# EAGLE schematic untitled (EAGLE 6.0)
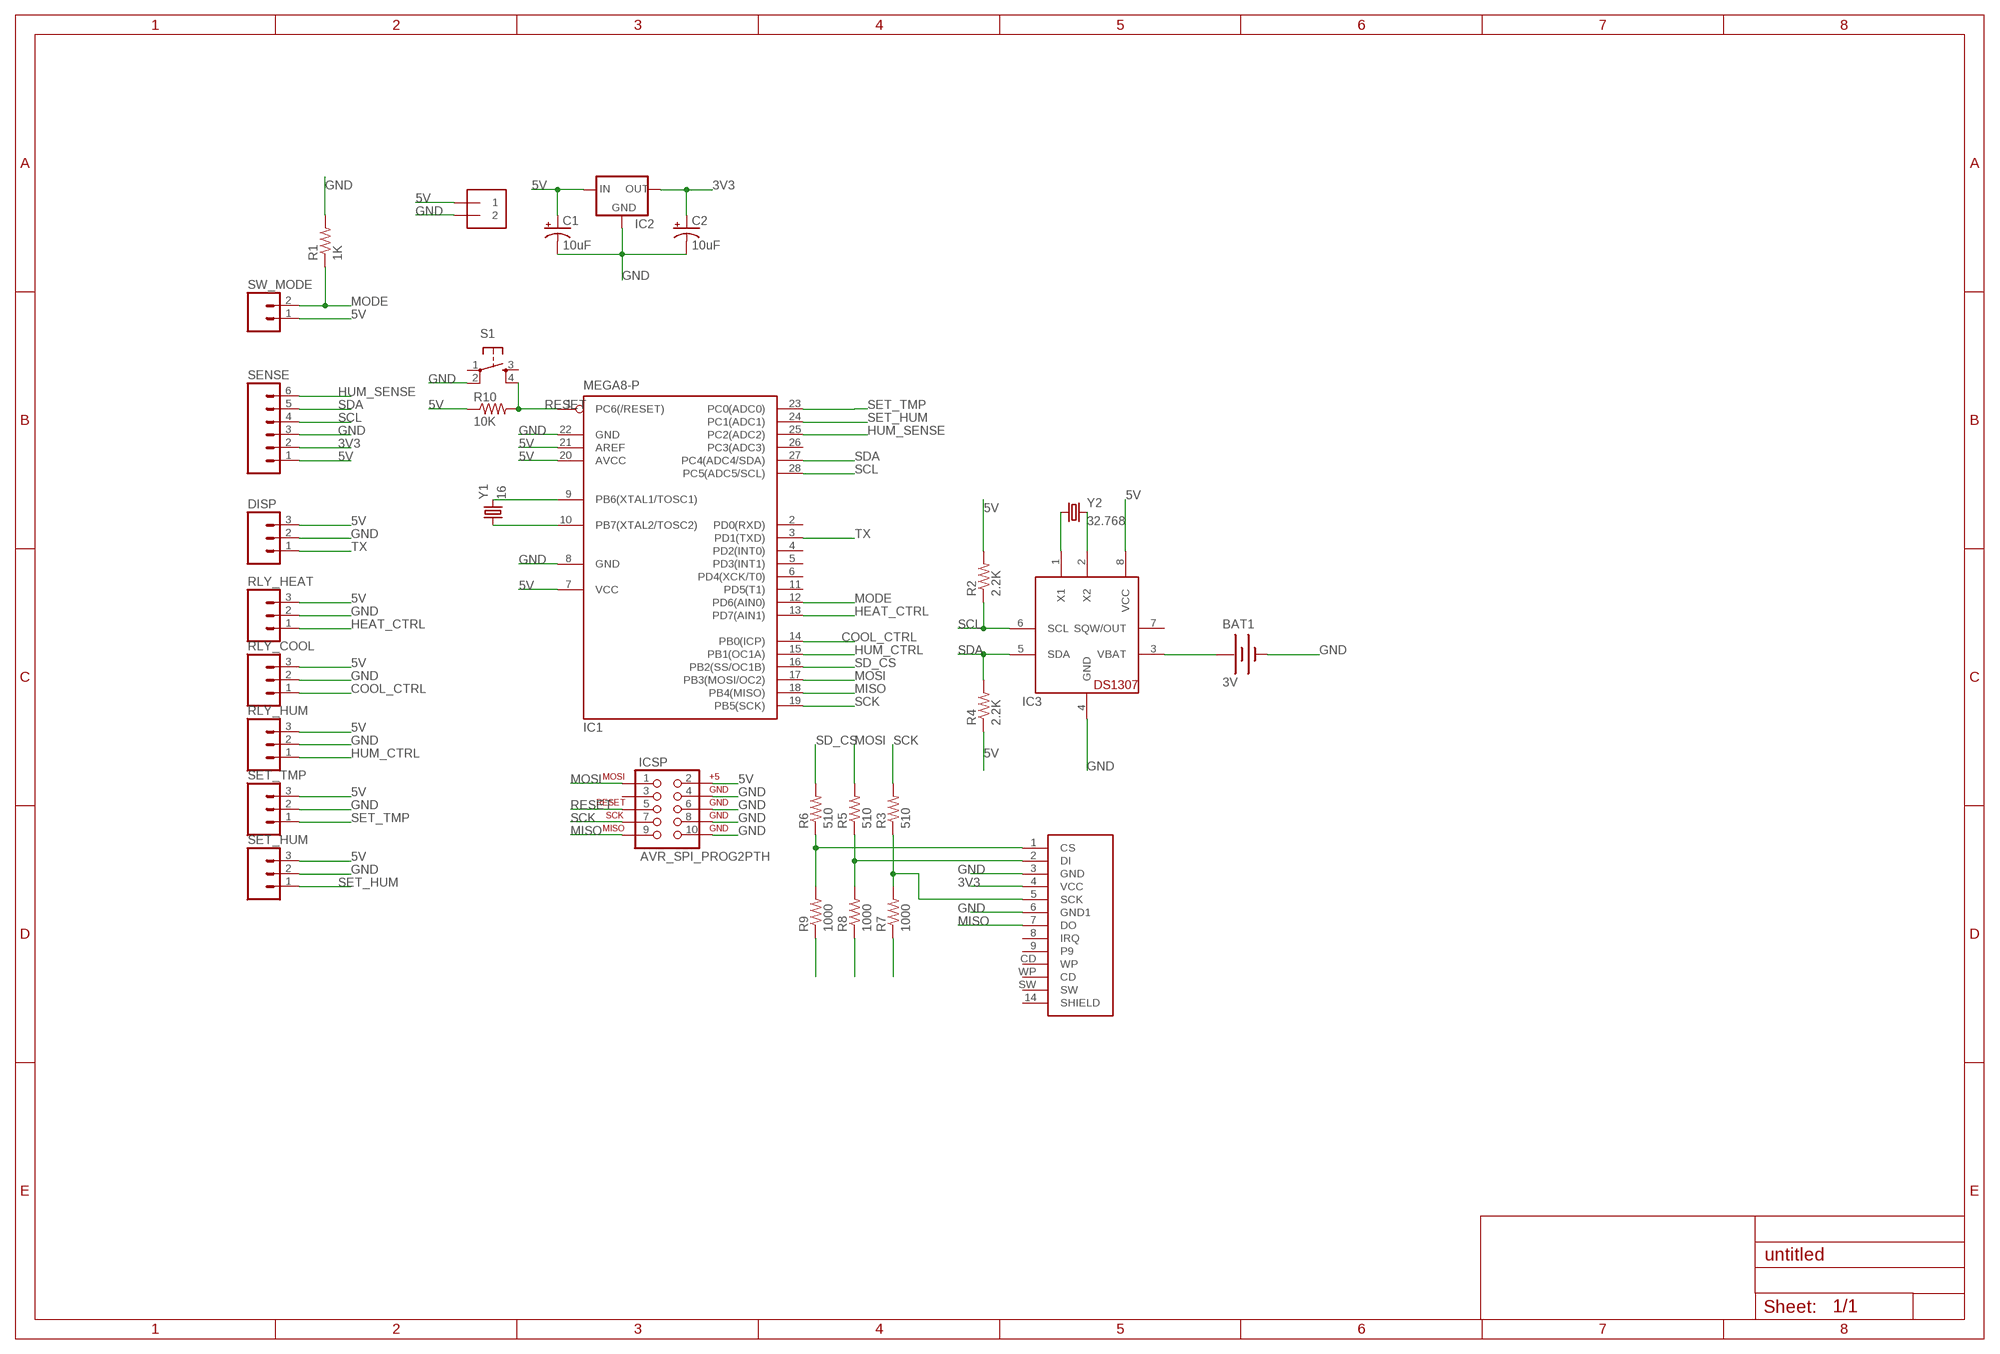
[diagram p0: schematic, sheet 1]

## Parts
BAT1  3V  BATTERY20PTH  [BATTCOM_20MM_PTH]
C1  10uF  CAP_POLPTH2  [CPOL-RADIAL-10UF-25V]
C2  10uF  CAP_POLPTH2  [CPOL-RADIAL-10UF-25V]
DISP  M03PTH  [1X03]
IC1  MEGA8-P  [DIL28-3]
IC2  V_REG_78XX-TO-220  [TO-220-ALT]
IC3  DS1307  [DIL08]
ICSP  AVR_SPI_PROG2PTH  [AVR_ICSP]
PWR_IN  1X2-3.5MM  [1X2-3.5MM]
R1  1K  RESISTORAXIAL-0.3  [AXIAL-0.3]
R2  2.2K  RESISTORAXIAL-0.3  [AXIAL-0.3]
R3  510  RESISTORAXIAL-0.3  [AXIAL-0.3]
R4  2.2K  RESISTORAXIAL-0.3  [AXIAL-0.3]
R5  510  RESISTORAXIAL-0.3  [AXIAL-0.3]
R6  510  RESISTORAXIAL-0.3  [AXIAL-0.3]
R7  1000  RESISTORAXIAL-0.3  [AXIAL-0.3]
R8  1000  RESISTORAXIAL-0.3  [AXIAL-0.3]
R9  1000  RESISTORAXIAL-0.3  [AXIAL-0.3]
R10  10K  RESISTORAXIAL-0.3  [AXIAL-0.3]
RLY_COOL  M03PTH  [1X03]
RLY_HEAT  M03PTH  [1X03]
RLY_HUM  M03PTH  [1X03]
S1  TAC_SWITCHPTH  [TACTILE-PTH]
SD_CARD  SD_CARD_SOCKETSD  [SD-MMC_SOCKET-PP]
SENSE  M06SIP  [1X06]
SET_HUM  M03PTH  [1X03]
SET_TMP  M03PTH  [1X03]
SW_MODE  M02JST-PTH-2  [JST-2-PTH]
Y1  16  CRYSTALHC49UV  [HC49U-V]
Y2  32.768  CRYSTALTC26H  [TC26H]

## Nets
3V3: C2.1(+) IC2.OUT SD_CARD.4(VCC) SENSE.2
5V: C1.1(+) DISP.3 IC1.7(VCC) IC1.20(AVCC) IC1.21(AREF) IC2.IN IC3.8(VCC) ICSP.2 PWR_IN.1 R2.P$2 R4.P$1 R10.P$1 RLY_COOL.3 RLY_HEAT.3 RLY_HUM.3 SENSE.1 SET_HUM.3 SET_TMP.3 SW_MODE.1
COOL_CTRL: IC1.14(PB0(ICP)) RLY_COOL.1
GND: BAT1.2(-) C1.2(-) C2.2(-) DISP.2 IC1.8(GND) IC1.22(GND) IC2.GND IC3.4(GND) ICSP.4 ICSP.6 ICSP.8 ICSP.10 PWR_IN.2 R1.P$2 R7.P$1 R8.P$1 R9.P$1 RLY_COOL.2 RLY_HEAT.2 RLY_HUM.2 S1.2 SD_CARD.3(GND) SD_CARD.6(GND1) SENSE.3 SET_HUM.2 SET_TMP.2
HEAT_CTRL: IC1.13(PD7(AIN1)) RLY_HEAT.1
HUM_CTRL: IC1.15(PB1(OC1A)) RLY_HUM.1
HUM_SENSE: IC1.25(PC2(ADC2)) SENSE.6
MISO: IC1.18(PB4(MISO)) ICSP.9 SD_CARD.7(DO)
MODE: IC1.12(PD6(AIN0)) R1.P$1 SW_MODE.2
MOSI: IC1.17(PB3(MOSI/OC2)) ICSP.1 R5.P$2
N$1: IC1.9(PB6(XTAL1/TOSC1)) Y1.2
N$2: IC1.10(PB7(XTAL2/TOSC2)) Y1.1
N$3: IC3.1(X1) Y2.1
N$4: IC3.2(X2) Y2.2
N$5: BAT1.1(+) IC3.3(VBAT)
N$9: R6.P$1 R9.P$2 SD_CARD.1(CS)
N$10: R5.P$1 R8.P$2 SD_CARD.2(DI)
N$11: R3.P$1 R7.P$2 SD_CARD.5(SCK)
RESET: IC1.1(PC6(/RESET)) ICSP.5 R10.P$2 S1.4
SCK: IC1.19(PB5(SCK)) ICSP.7 R3.P$2
SCL: IC1.28(PC5(ADC5/SCL)) IC3.6(SCL) R2.P$1 SENSE.4
SD_CS: IC1.16(PB2(SS/OC1B)) R6.P$2
SDA: IC1.27(PC4(ADC4/SDA)) IC3.5(SDA) R4.P$2 SENSE.5
SET_HUM: IC1.24(PC1(ADC1)) SET_HUM.1
SET_TMP: IC1.23(PC0(ADC0)) SET_TMP.1
TX: DISP.1 IC1.3(PD1(TXD))
Unconnected: IC1.2(PD0(RXD)) IC1.4(PD2(INT0)) IC1.5(PD3(INT1)) IC1.6(PD4(XCK/T0)) IC1.11(PD5(T1)) IC1.26(PC3(ADC3)) IC3.7(SQW/OUT) ICSP.3 S1.1 S1.3 SD_CARD.8(IRQ) SD_CARD.9 SD_CARD.14(SHIELD) SD_CARD.CD(WP) SD_CARD.SW SD_CARD.WP(CD)

## Library data of the parts
BAT1 = SparkFun-Electromechanical:BATTERY: Battery Holders Various common sizes : AA, AAA, 20mm coin cell and 12mm coin cell.
C1 C2 = SparkFun-Passives:CAP_POL: Capacitor Polarized These are standard SMD and PTH capacitors. Normally 10uF, 47uF, and 100uF in electrolytic and tantalum varieties. Always verify the external diameter of the through hole cap, it varies with capacity, voltage, and manufacturer. The EIA devices should be standard.
DISP RLY_COOL RLY_HEAT RLY_HUM SET_HUM SET_TMP = SparkFun-Connectors:M03: Header 3 Standard 3-pin 0.1" header. Use with straight break away headers (SKU : PRT-00116), right angle break away headers (PRT-00553), swiss pins (PRT-00743), machine pins (PRT-00117), and female headers (PRT-00115). Molex polarized connector foot print use with SKU : PRT-08232 with associated crimp pins and housings.
IC1 = atmel:MEGA8-P: MICROCONTROLLER 8 Kbytes FLASH, 1 kbytes SRAM, 512 bytes EEPROM, USART, 4-channel 10 bit ADC, 2-channel 8 bit ADC Pin compatible with Atmega48, ATMega88, ATMega168 Source: avr.lbr; OC_FARNELL: unknown; OC_NEWARK: unknown
IC2 = SparkFun-PowerIC:V_REG_78XX: Voltage Regulator Standard 7805 5V regulator. IGO (Input Ground Output). Spark Fun Electronics SKU : COM-00107
IC3 = adafruit:DS1307: DS1307 Real time clock (RTC) with battery backup ability. Talk to it via i2c
ICSP = SparkFun:AVR_SPI_PROG2: AVR ICSP Header This is the standard AVR In Circuit Serial Programming header. Minimal, but includes pin one indicator. Works with standard Olimex programmers. Also look for the 6-pin reduced version. Spark Fun Electronics SKU: PRT-00778
PWR_IN = adafruit:1X2: 3.5mm Terminal block http://www.ladyada.net/library/pcb/eaglelibrary.html
R1-R9 = SparkFun-Passives:RESISTOR: Resistor Basic schematic elements and footprints for 0603, 1206, and PTH resistors.
R10 = SparkFun:RESISTOR: Resistor Basic schematic elements and footprints for 0603, 1206, and PTH resistors.
S1 = SparkFun:TAC_SWITCH: Momentary Switch Button commonly used for reset or general input. Spark Fun Electronics SKU : COM-00097
SD_CARD = SparkFun-Connectors:SD_CARD_SOCKET: SD/MMC Socket Media socket for SD and MMC cards. Push-push type. Schematic element and footprint production proven. Spark Fun Electronics SKU : PRT-00136
SENSE = SparkFun-Connectors:M06: Header 6 Standard 6-pin 0.1" header. Use with straight break away headers (SKU : PRT-00116), right angle break away headers (PRT-00553), swiss pins (PRT-00743), machine pins (PRT-00117), and female headers (PRT-00115). Molex polarized connector foot print use with SKU : PRT-08094 with associated crimp pins and housings. NOTES ON THE VARIANTS LOCK and LOCK_LONGPADS... This footprint was designed to help hold the alignment of a through-hole component (i.e. 6-pin header) while soldering it into place. You may notice that each hole has been shifted either up or down by 0.005 of an inch from it's more standard position (which is a perfectly straight line). This slight alteration caused the pins (the squares in the middle) to touch the edges of the holes. Because they are alternating, it causes a "brace" to hold the component in place. 0.005 has proven to be the perfect amount of "off-center" position when using our standard breakaway headers. Although looks a little odd when you look at the bare footprint, once you have a header in there, the alteration is very hard to notice. Also, if you push a header all the way into place, it is covered up entirely on the bottom side. This idea of altering the position of holes to aid alignment will be further integrated into the Sparkfun Library for other footprints. It can help hold any component with 3 or more connection pins.
SW_MODE = SparkFun-Connectors:M02: Header 2 Standard 2-pin 0.1" header. Use with straight break away headers (SKU : PRT-00116), right angle break away headers (PRT-00553), swiss pins (PRT-00743), machine pins (PRT-00117), and female headers (PRT-00115). Molex polarized connector foot print use with SKU : PRT-08233 with associated crimp pins and housings.
Y1 Y2 = SparkFun-FreqCtrl:CRYSTAL: Various standard crystals. Proven footprints. Spark Fun Electronics SKU : COM-00534